# EAGLE design OpenPilot-v1 (EAGLE 5.06)

## Sheet 1 of 2
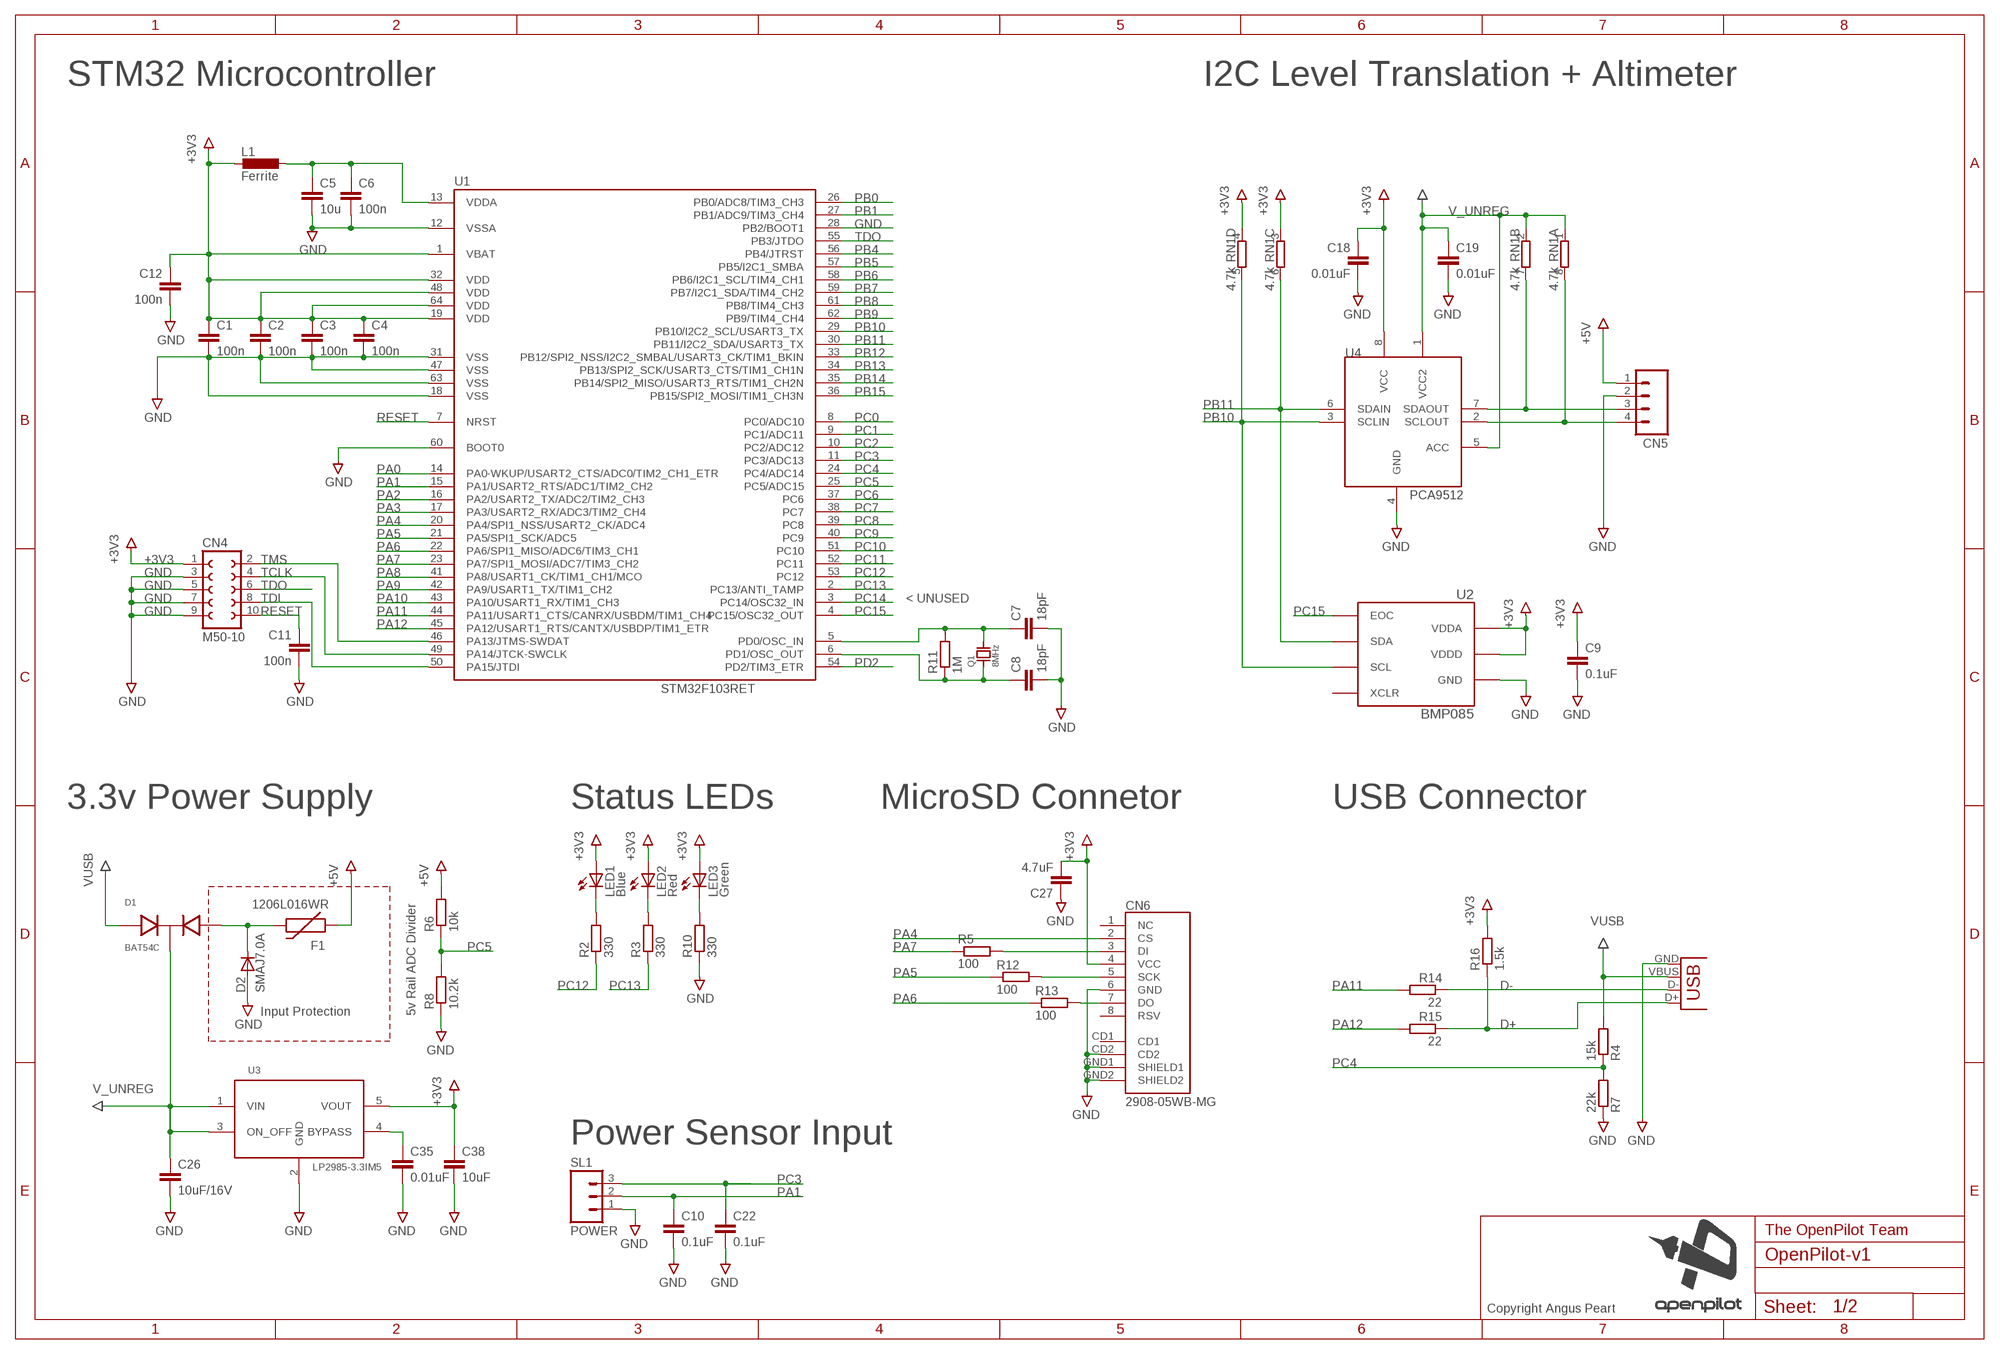
[diagram p0: schematic, sheet 1]

### Parts
C1  100n  C-EUC0603  [C0603]
C2  100n  C-EUC0603  [C0603]
C3  100n  C-EUC0603  [C0603]
C4  100n  C-EUC0603  [C0603]
C5  10u  C-EUC0805  [C0805]
C6  100n  C-EUC0603  [C0603]
C7  18pF  C-EUC0603  [C0603]
C8  18pF  C-EUC0603  [C0603]
C9  0.1uF  CAPACITOR0603  [0603]
C10  0.1uF  C-EUC0603  [C0603]
C11  100n  C-EUC0603  [C0603]
C12  100n  C-EUC0603  [C0603]
C18  0.01uF  C-EUC0603  [C0603]
C19  0.01uF  C-EUC0603  [C0603]
C22  0.1uF  C-EUC0603  [C0603]
C26  10uF/16V  C-EUC0805  [C0805]
C27  4.7uF  C-EUC0805  [C0805]
C35  0.01uF  C-EUC0603  [C0603]
C38  10uF  C-EUC0805  [C0805]
CN4  M50-10  [M50-10]
CN5  M04PTH  [1X04]
CN6  2908-05WB-MG  USD-SOCKETNEW  [MICRO-SD-SOCKET-PP]
D1  BAT54C  [SOT23]
D2  SMAJ7.0A  DIODESMA  [SMA-DIODE]
F1  1206L016WR  PTCSMD  [PTC-1206]
L1  Ferrite  L-EUL2012C  [L2012C]
LED1  Blue  LEDCHIPLED_0603  [CHIPLED_0603]
LED2  Red  LEDCHIPLED_0603  [CHIPLED_0603]
LED3  Green  LEDCHIPLED_0603  [CHIPLED_0603]
Q1  8MHz  CRYSTAL5X3  [CRYSTAL-5X3]
R2  330  R-EU_R0603  [R0603]
R3  330  R-EU_R0603  [R0603]
R4  15k  R-EU_R0603  [R0603]
R5  100  R-EU_R0603  [R0603]
R6  10k  R-EU_R0603  [R0603]
R7  22k  R-EU_R0603  [R0603]
R8  10.2k  R-EU_R0603  [R0603]
R10  330  R-EU_R0603  [R0603]
R11  1M  R-EU_R0603  [R0603]
R12  100  R-EU_R0603  [R0603]
R13  100  R-EU_R0603  [R0603]
R14  22  R-EU_R0603  [R0603]
R15  22  R-EU_R0603  [R0603]
R16  1.5k  R-EU_R0603  [R0603]
RN1  4.7k  4R-N0603-ARC  [0603-ARC]
SL1  POWER  M03PTH  [1X03]
U1  STM32F103RET  [LQFP-64]
U2  BMP085  [BMP085]
U3  LP2985-3.3IM5  [SOT23-5]
U4  PCA9512  [TSSOP8]
X1  USBSMD  [USB-MINIB]

### Nets
5V_SCL: CN5.4 RN1.8 U4.2(SCLOUT)
5V_SDA: CN5.3 RN1.7 U4.7(SDAOUT)
+3V3: C1.1 C2.1 C3.1 C4.1 C9.1 C12.1 C18.1 C27.2 C38.1 CN4.1 CN6.4(VCC) L1.2 LED1.A LED2.A LED3.A R16.2 RN1.3 RN1.4 U1.1(VBAT) U1.19(VDD) U1.32(VDD) U1.48(VDD) U1.64(VDD) U2.3(VDDA) U2.4(VDDD) U3.5(VOUT) U4.8(VCC)
+5V: CN5.1 F1.1 R6.2 ; also sheet 2
+5V-PRO: D1.2 D2.C F1.2
D+: R15.1 R16.1 X1.D+
D-: R14.1 X1.D-
GND: C1.2 C2.2 C3.2 C4.2 C5.2 C6.2 C7.2 C8.2 C9.2 C10.2 C11.2 C12.2 C18.2 C19.2 C22.2 C26.2 C27.1 C35.2 C38.2 CN4.3 CN4.5 CN4.7 CN4.9 CN5.2 CN6.6(GND) CN6.CD2 CN6.GND1(SHIELD1) CN6.GND2(SHIELD2) D2.A R7.1 R8.1 R10.1 SL1.1 U1.12(VSSA) U1.18(VSS) U1.28(PB2/BOOT1) U1.31(VSS) U1.47(VSS) U1.60(BOOT0) U1.63(VSS) U2.1(GND) U3.2(GND) U4.4(GND) X1.GND ; also sheet 2
N$2: LED1.C R2.2
N$4: LED2.C R3.2
N$11: LED3.C R10.2
N$12: C7.1 Q1.3 R11.2 U1.5(PD0/OSC_IN)
N$13: C5.1 C6.1 L1.1 U1.13(VDDA)
N$14: C8.1 Q1.1 R11.1 U1.6(PD1/OSC_OUT)
N$16: CN6.3(DI) R5.2
N$18: CN6.5(SCK) R12.2
N$19: CN6.7(DO) R13.2
N$38: C35.1 U3.4(BYPASS)
PA0: U1.14(PA0-WKUP/USART2_CTS/ADC0/TIM2_CH1_ETR) ; also sheet 2
PA1: C10.1 SL1.2 U1.15(PA1/USART2_RTS/ADC1/TIM2_CH2)
PA2: U1.16(PA2/USART2_TX/ADC2/TIM2_CH3) ; also sheet 2
PA3: U1.17(PA3/USART2_RX/ADC3/TIM2_CH4) ; also sheet 2
PA4: CN6.2(CS) U1.20(PA4/SPI1_NSS/USART2_CK/ADC4)
PA5: R12.1 U1.21(PA5/SPI1_SCK/ADC5)
PA6: R13.1 U1.22(PA6/SPI1_MISO/ADC6/TIM3_CH1)
PA7: R5.1 U1.23(PA7/SPI1_MOSI/ADC7/TIM3_CH2)
PA8: U1.41(PA8/USART1_CK/TIM1_CH1/MCO) ; also sheet 2
PA9: U1.42(PA9/USART1_TX/TIM1_CH2) ; also sheet 2
PA10: U1.43(PA10/USART1_RX/TIM1_CH3) ; also sheet 2
PA11: R14.2 U1.44(PA11/USART1_CTS/CANRX/USBDM/TIM1_CH4)
PA12: R15.2 U1.45(PA12/USART1_RTS/CANTX/USBDP/TIM1_ETR)
PB0: U1.26(PB0/ADC8/TIM3_CH3) ; also sheet 2
PB1: U1.27(PB1/ADC9/TIM3_CH4) ; also sheet 2
PB4: U1.56(PB4/JTRST) ; also sheet 2
PB5: U1.57(PB5/I2C1_SMBA) ; also sheet 2
PB6: U1.58(PB6/I2C1_SCL/TIM4_CH1) ; also sheet 2
PB7: U1.59(PB7/I2C1_SDA/TIM4_CH2) ; also sheet 2
PB8: U1.61(PB8/TIM4_CH3) ; also sheet 2
PB9: U1.62(PB9/TIM4_CH4) ; also sheet 2
PB10: RN1.5 U1.29(PB10/I2C2_SCL/USART3_TX) U2.6(SCL) U4.3(SCLIN)
PB11: RN1.6 U1.30(PB11/I2C2_SDA/USART3_TX) U2.7(SDA) U4.6(SDAIN)
PB12: U1.33(PB12/SPI2_NSS/I2C2_SMBAL/USART3_CK/TIM1_BKIN) ; also sheet 2
PB13: U1.34(PB13/SPI2_SCK/USART3_CTS/TIM1_CH1N) ; also sheet 2
PB14: U1.35(PB14/SPI2_MISO/USART3_RTS/TIM1_CH2N) ; also sheet 2
PB15: U1.36(PB15/SPI2_MOSI/TIM1_CH3N) ; also sheet 2
PC0: U1.8(PC0/ADC10) ; also sheet 2
PC1: U1.9(PC1/ADC11) ; also sheet 2
PC2: U1.10(PC2/ADC12) ; also sheet 2
PC3: C22.1 SL1.3 U1.11(PC3/ADC13)
PC4: R4.1 R7.2 U1.24(PC4/ADC14)
PC5: R6.1 R8.2 U1.25(PC5/ADC15)
PC6: U1.37(PC6) ; also sheet 2
PC7: U1.38(PC7) ; also sheet 2
PC8: U1.39(PC8) ; also sheet 2
PC9: U1.40(PC9) ; also sheet 2
PC10: U1.51(PC10) ; also sheet 2
PC11: U1.52(PC11) ; also sheet 2
PC12: R2.1 U1.53(PC12)
PC13: R3.1 U1.2(PC13/ANTI_TAMP)
PC14: U1.3(PC14/OSC32_IN)
PC15: U1.4(PC15/OSC32_OUT) U2.2(EOC)
PD2: U1.54(PD2/TIM3_ETR) ; also sheet 2
RESET: C11.1 CN4.10 U1.7(NRST)
TCLK: CN4.4 U1.49(PA14/JTCK-SWCLK)
TDI: CN4.8 U1.50(PA15/JTDI)
TDO: CN4.6 U1.55(PB3/JTDO)
TMS: CN4.2 U1.46(PA13/JTMS-SWDAT)
V_UNREG: C19.1 C26.1 D1.3 RN1.1 RN1.2 U3.1(VIN) U3.3(ON_OFF) U4.1(VCC2) U4.5(ACC)
VUSB: D1.1 R4.2 X1.VBUS
Unconnected: CN6.1(NC) CN6.8(RSV) CN6.CD1 U2.8(XCLR)

### Notes on the sheet
- STM32 Microcontroller | I2C Level Translation + Altimeter
- < UNUSED
- 3.3v Power Supply | Status LEDs | MicroSD Connetor | USB Connector
- Input Protection | 5v Rail ADC Divider
- Power Sensor Input
- The OpenPilot Team
- Copyright Angus Peart

## Sheet 2 of 2
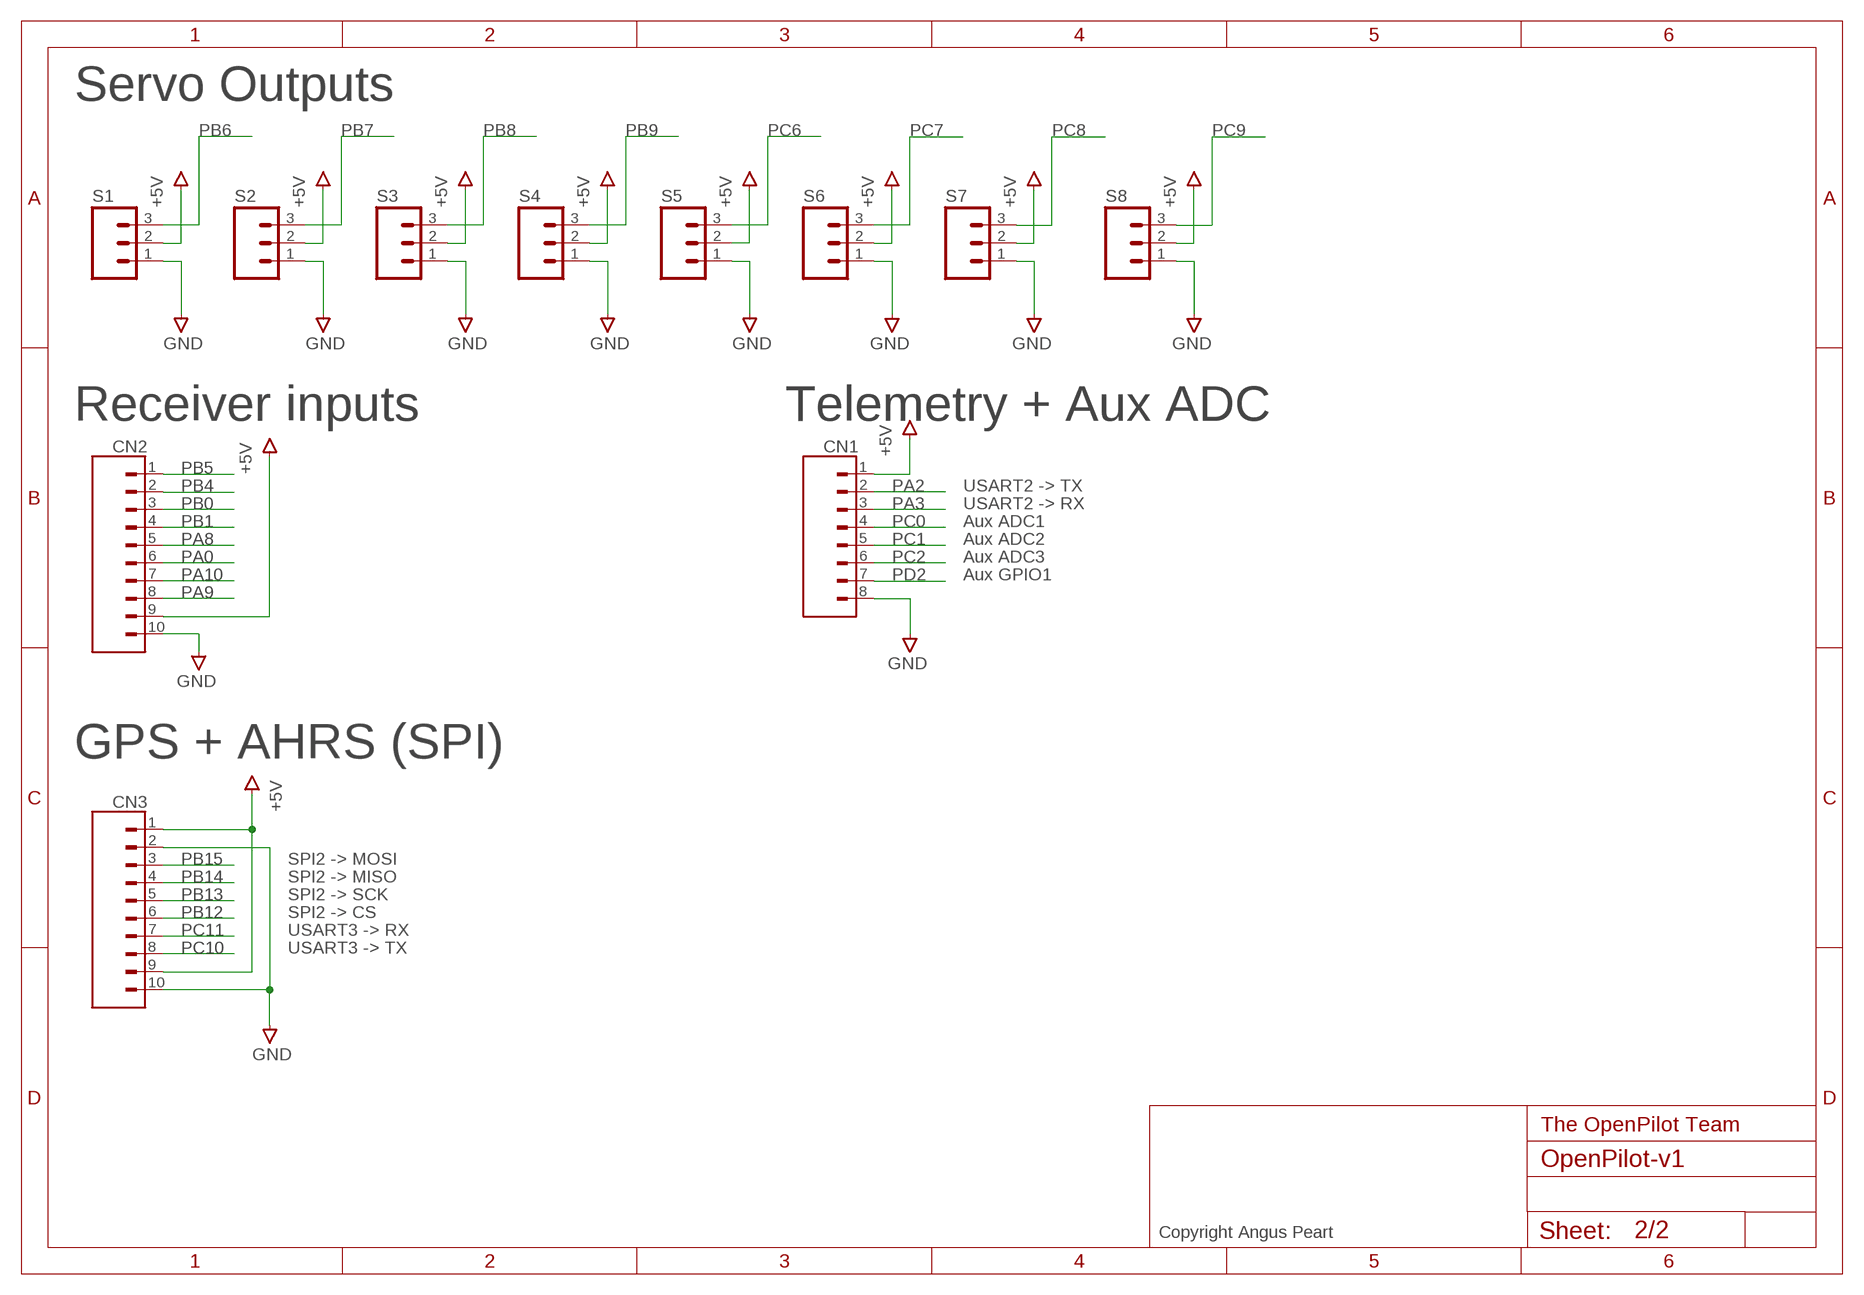
[diagram p1: schematic, sheet 2]

### Parts
CN1  BM08B-SRSS-TB  [BM08B-SRSS-TB]
CN2  BM10B-SRSS-TB  [BM10B-SRSS-TB]
CN3  BM10B-SRSS-TB  [BM10B-SRSS-TB]
S1  M03PTH  [1X03]
S2  M03PTH  [1X03]
S3  M03PTH  [1X03]
S4  M03PTH  [1X03]
S5  M03PTH  [1X03]
S6  M03PTH  [1X03]
S7  M03PTH  [1X03]
S8  M03PTH  [1X03]

### Nets
+5V: CN1.1 CN2.9 CN3.1 CN3.9 S1.2 S2.2 S3.2 S4.2 S5.2 S6.2 S7.2 S8.2 ; also sheet 1
GND: CN1.8 CN2.10 CN3.2 CN3.10 S1.1 S2.1 S3.1 S4.1 S5.1 S6.1 S7.1 S8.1 ; also sheet 1
PA0: CN2.6 ; also sheet 1
PA2: CN1.2 ; also sheet 1
PA3: CN1.3 ; also sheet 1
PA8: CN2.5 ; also sheet 1
PA9: CN2.8 ; also sheet 1
PA10: CN2.7 ; also sheet 1
PB0: CN2.3 ; also sheet 1
PB1: CN2.4 ; also sheet 1
PB4: CN2.2 ; also sheet 1
PB5: CN2.1 ; also sheet 1
PB6: S1.3 ; also sheet 1
PB7: S2.3 ; also sheet 1
PB8: S3.3 ; also sheet 1
PB9: S4.3 ; also sheet 1
PB12: CN3.6 ; also sheet 1
PB13: CN3.5 ; also sheet 1
PB14: CN3.4 ; also sheet 1
PB15: CN3.3 ; also sheet 1
PC0: CN1.4 ; also sheet 1
PC1: CN1.5 ; also sheet 1
PC2: CN1.6 ; also sheet 1
PC6: S5.3 ; also sheet 1
PC7: S6.3 ; also sheet 1
PC8: S7.3 ; also sheet 1
PC9: S8.3 ; also sheet 1
PC10: CN3.8 ; also sheet 1
PC11: CN3.7 ; also sheet 1
PD2: CN1.7 ; also sheet 1

### Notes on the sheet
- Servo Outputs
- Receiver inputs | Telemetry + Aux ADC
- USART2 -> TX
- USART2 -> RX
- Aux ADC1
- Aux ADC2
- Aux ADC3
- Aux GPIO1
- GPS + AHRS (SPI)
- SPI2 -> MOSI
- SPI2 -> MISO
- SPI2 -> SCK
- SPI2 -> CS
- USART3 -> RX
- USART3 -> TX
- The OpenPilot Team
- Copyright Angus Peart

## Library data of the parts
C1-C8 C10-C12 C18 C19 C22 C26 C27 C35 C38 = rcl:C-EU: CAPACITOR, European symbol
C9 = GUS Eng:CAPACITOR: Capacitor Standard SMD ceramic capacitors.
CN1 = zik:BM08B-SRSS-TB: JST SR connector - 8 pins, SMT
CN2 CN3 = zik:BM10B-SRSS-TB: JST SR connector -10 pins, SMT
CN4 = zik:M50-10: Harwin M50 1.27mm spaced 10 pin 2 row header
CN5 = sparkfun:M04: Header 4 Standard 4-pin 0.1" header. Use with straight break away headers (SKU : PRT-00116), right angle break away headers (PRT-00553), swiss pins (PRT-00743), machine pins (PRT-00117), and female headers (PRT-00115). Molex polarized connector foot print use with SKU : PRT-08231 with associated crimp pins and housings.
CN6 = sparkfun:USD-SOCKET: microSD Socket Push-push type uSD socket. Schematic element and footprint production proven. Spark Fun Electronics SKU : PRT-00127. tDoc lines correctly indicate media card edge positions when inserting (unlocked, locked, depressed).
D1 = zik:BAT54C: Dual schottky diode
D2 = sparkfun:DIODE: Diode These are standard reverse protection diodes and small signal diodes. SMA package can handle up to about 1A. SOD-323 can handle about 200mA. What the SOD-323 package when ordering, there are some mfgs out there that are 5-pin packages.
F1 = sparkfun:PTC: Resettable Fuse PTC Resettable Fuse. Spark Fun Electronics SKU : COM-08357
L1 = rcl:L-EU: INDUCTOR, European symbol
LED1-LED3 = led:LED: LED OSRAM: - CHIPLED LG R971, LG N971, LY N971, LG Q971, LY Q971, LO R971, LY R971 LH N974, LH R974 LS Q976, LO Q976, LY Q976 LO Q996 - Hyper CHIPLED LW Q18S LB Q993, LB Q99A, LB R99A - SideLED LS A670, LO A670, LY A670, LG A670, LP A670 LB A673, LV A673, LT A673, LW A673 LH A674 LY A675 LS A676, LA A676, LO A676, LY A676, LW A676 LS A679, LY A679, LG A679 - Hyper Micro SIDELED® LS Y876, LA Y876, LO Y876, LY Y876 LT Y87S - SmartLED LW L88C, LW L88S LB L89C, LB L89S, LG L890 LS L89K, LO L89K, LY L89K LS L896, LA L896, LO L896, LY L896 - TOPLED LS T670, LO T670, LY T670, LG T670, LP T670 LSG T670, LSP T670, LSY T670, LOP T670, LYG T670 LG T671, LOG T671, LSG T671 LB T673, LV T673, LT T673, LW T673 LH T674 LS T676, LA T676, LO T676, LY T676, LB T676, LH T676, LSB T676, LW T676 LB T67C, LV T67C, LT T67C, LS T67K, LO T67K, LY T67K, LW E67C LS E67B, LA E67B, LO E67B, LY E67B, LB E67C, LV E67C, LT E67C LW T67C LS T679, LY T679, LG T679 LS T770, LO T770, LY T770, LG T770, LP T770 LB T773, LV T773, LT T773, LW T773 LH T774 LS E675, LA E675, LY E675, LS T675 LS T776, LA T776, LO T776, LY T776, LB T776 LHGB T686 LT T68C, LB T68C - Hyper Mini TOPLED® LB M676 - Mini TOPLED Santana® LG M470 LS M47K, LO M47K, LY M47K Source: http://www.osram.convergy.de LUXEON: - LUMILED® LXK2-PW12-R00, LXK2-PW12-S00, LXK2-PW14-U00, LXK2-PW14-V00 LXK2-PM12-R00, LXK2-PM12-S00, LXK2-PM14-U00 LXK2-PE12-Q00, LXK2-PE12-R00, LXK2-PE12-S00, LXK2-PE14-T00, LXK2-PE14-U00 LXK2-PB12-K00, LXK2-PB12-L00, LXK2-PB12-M00, LXK2-PB14-N00, LXK2-PB14-P00, LXK2-PB14-Q00 LXK2-PR12-L00, LXK2-PR12-M00, LXK2-PR14-Q00, LXK2-PR14-R00 LXK2-PD12-Q00, LXK2-PD12-R00, LXK2-PD12-S00 LXK2-PH12-R00, LXK2-PH12-S00 LXK2-PL12-P00, LXK2-PL12-Q00, LXK2-PL12-R00 Source: www.luxeon.com KINGBRIGHT: KA-3528ASYC Source: www.kingbright.com
Q1 = GUS Eng:CRYSTAL: Crystals 5x3 Package: Digikey part: CTX639CT-ND (12MHz 13pF)
R2-R8 R10-R16 = rcl:R-EU_: RESISTOR, European symbol
RN1 = resistor-dil:4R-N: Array Chip Resistor Source: RS Component / Phycomp
S1-S8 SL1 = sparkfun:M03: Header 3 Standard 3-pin 0.1" header. Use with straight break away headers (SKU : PRT-00116), right angle break away headers (PRT-00553), swiss pins (PRT-00743), machine pins (PRT-00117), and female headers (PRT-00115). Molex polarized connector foot print use with SKU : PRT-08232 with associated crimp pins and housings.
U1 = zik:STM32F103*: Cortex M3 ARM-based 32-bit MCU with 64KB to 512KB Flash, 20KB to 64KB RAM, USB, CAN, 11 timers, 3 ADCs, 13 communication interfaces
U2 = GUS Eng:BMP085: BMP085 Digital Pressure Sensor Digikey #: 828-1005-1-ND
U3 = zik:LP2985-*: National Semiconductor LP2985 LDO regulator
U4 = zik:PCA9512: Phillips PCA9512 I2C level translator
X1 = sparkfun:USB: USB Connectors USB-B-PTH is fully proven SKU : PRT-00139 USB-miniB is fully proven SKU : PRT-00587 USB-A-PCB is untested. USB-A-H is throughly reviewed, but untested. Spark Fun Electronics SKU : PRT-00437 USB-B-SMT is throughly reviewed, but untested. Needs silkscreen touching up. USB-A-S has not been used/tested USB-MB-H has not been used/tested

## Board
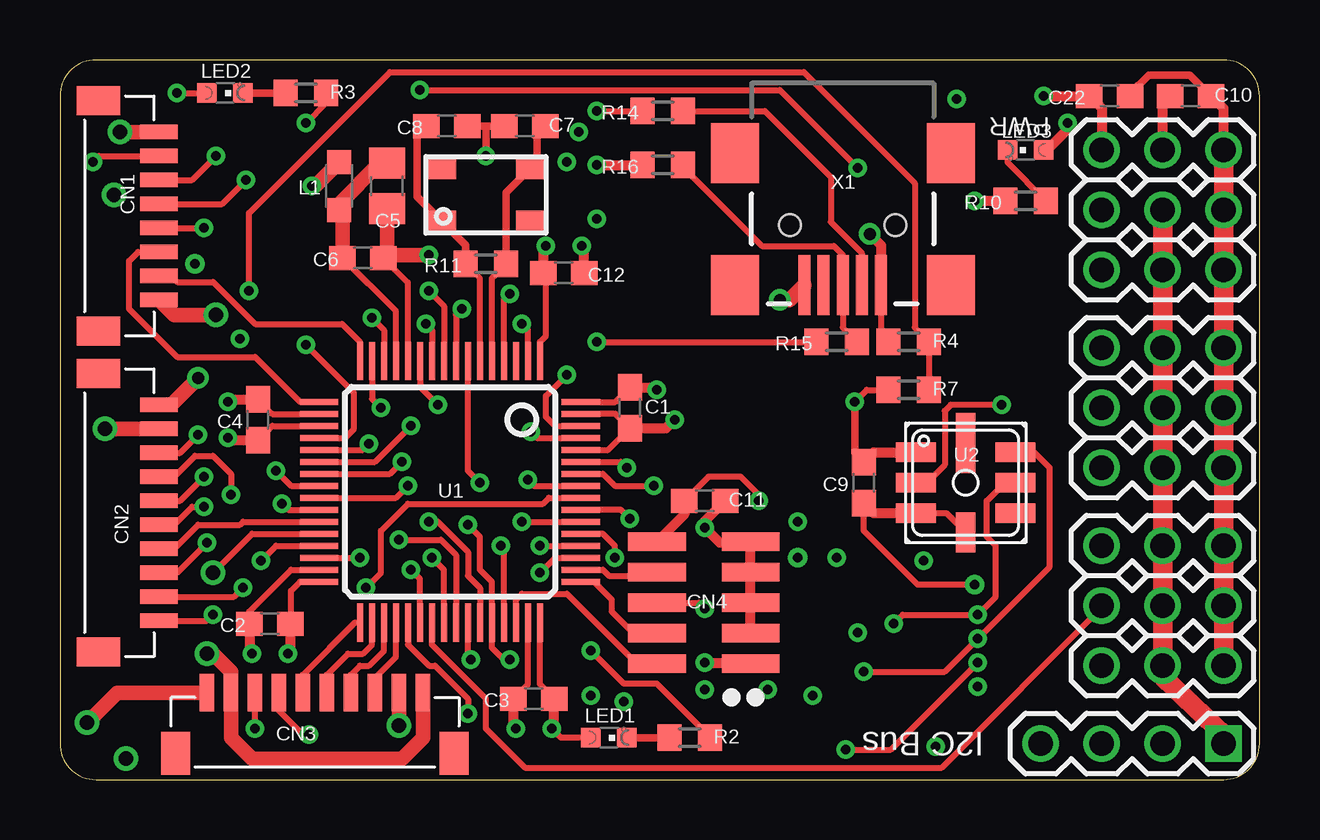
[diagram p2: board, top side]
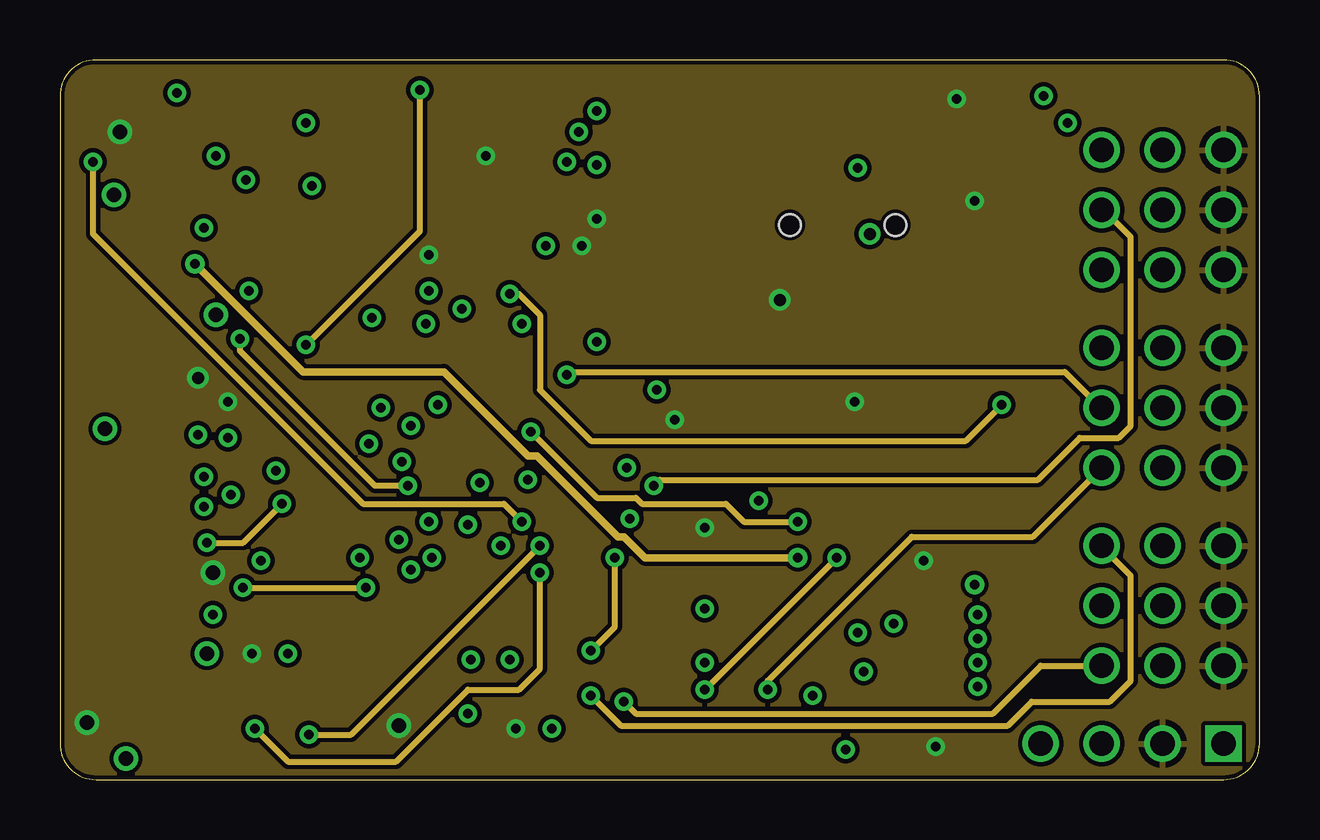
[diagram p3: board, inner layer Route2]
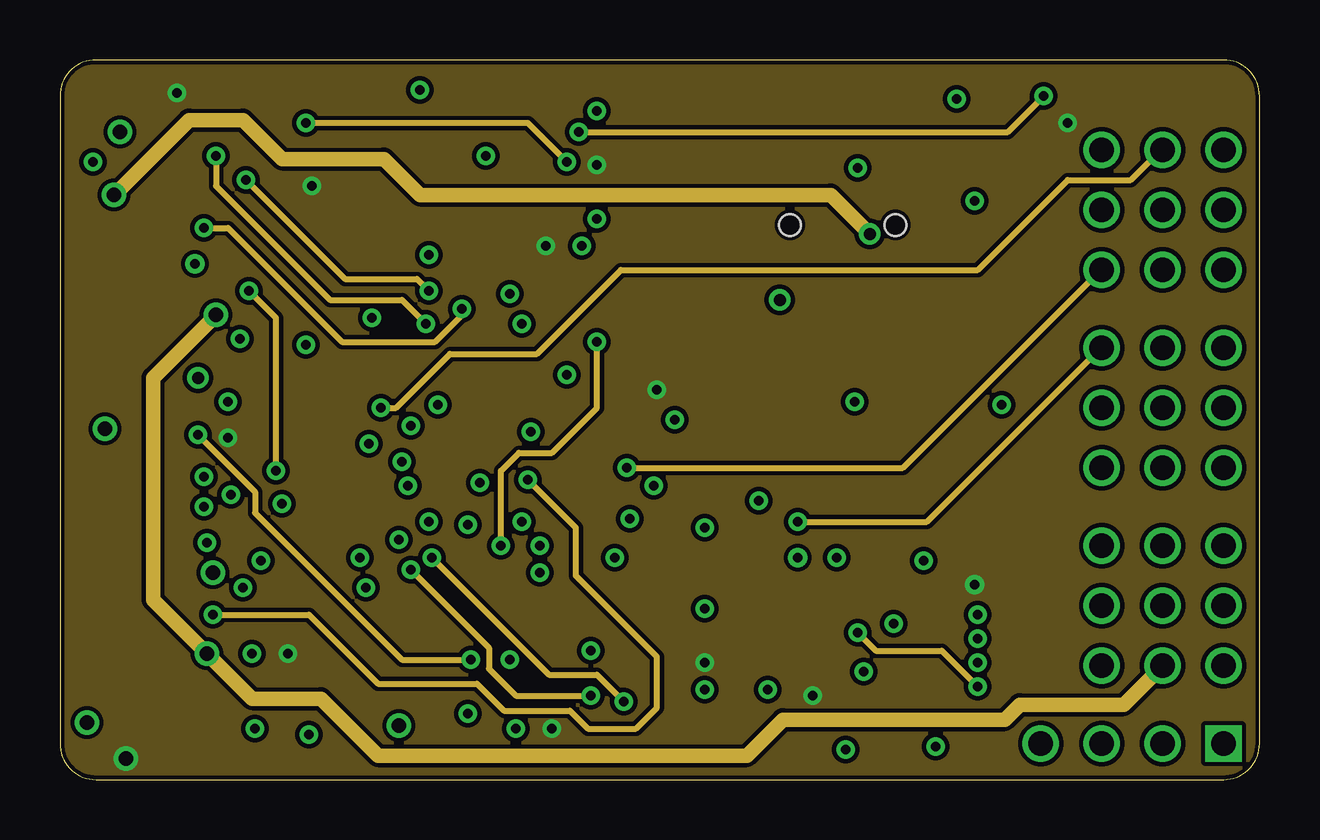
[diagram p4: board, inner layer Route15]
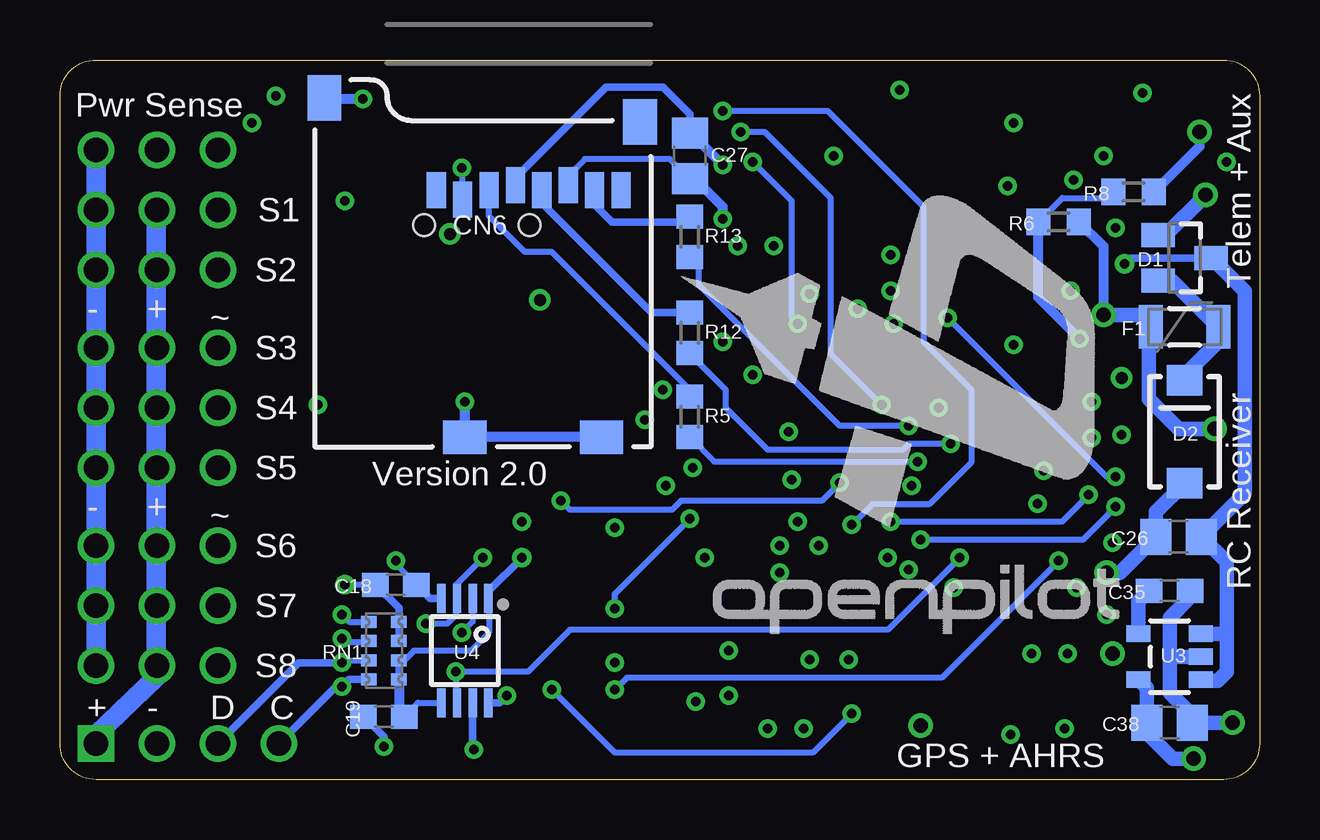
[diagram p5: board, bottom side, seen from below]

Size 50 x 30 mm. Coordinates in mm from the lower left corner, seen from the top.
Outline: 48.5,0 arc90 50,1.5 50,28.5 arc90 48.5,30 1.5,30 arc90 0,28.5 0,1.5 arc90 1.5,0 48.5,0
Copper layers (1*2+15*16): Top 0.0356mm / dielectric 1.5011mm / Route2 0.0356mm / dielectric 0.1499mm / Route15 0.0356mm / dielectric 0.2007mm / Bottom 0.0356mm
Design rules "7mils GUS Engineering (4 Layer) *": minimum track width 7mil, minimum drill 15mil, track to track 7mil, track to pad 7mil, pad to pad 7mil, via to via 7mil, smd to smd 0mil, copper to edge 7mil, drill to drill 7mil, minimum pad ring 10mil, minimum via ring 8mil, stop-mask expansion 4mil, vias tented up to drill 25mil, thermal gap 10mil

### Footprints (pad centres in the part's own frame; a part is rotated, then mirrored left to right if it is on the bottom)
C0603 = smd 1.1 x 1: 1 -0.85,0; 2 0.85,0
C0805 = smd 1.3 x 1.5: 1 -0.95,0; 2 0.95,0
0603 = smd 1.1 x 1: 1 -0.85,0; 2 0.85,0
BM08B-SRSS-TB = smd 0.6 x 1.55: 1 7,0; 2 6,0; 3 5,0; 4 4,0; 5 3,0; 6 2,0; 7 1,0; 8 0,0 | smd 1.2 x 1.8: NC@1 -1.3,-2.525; NC@2 8.3,-2.525
BM10B-SRSS-TB = smd 0.6 x 1.55: 1 9,0; 2 8,0; 3 7,0; 4 6,0; 5 5,0; 6 4,0; 7 3,0; 8 2,0; 9 1,0; 10 0,0 | smd 1.2 x 1.8: NC@1 -1.3,-2.525; NC@2 10.3,-2.525
M50-10 = smd 0.76 x 2.4: 1 -2.54,-1.95; 2 -2.54,1.95; 3 -1.27,-1.95; 4 -1.27,1.95; 5 0,-1.95; 6 0,1.95; 7 1.27,-1.95; 8 1.27,1.95; 9 2.54,-1.95; 10 2.54,1.95
1X04 = drill 1.016 square: 1 0,0 | drill 1.016 round: 2 2.54,0; 3 5.08,0; 4 7.62,0
MICRO-SD-SOCKET-PP = smd 0.8 x 1.5: 1 -8.94,10.7; 2 -7.84,10.3; 3 -6.74,10.7; 4 -5.64,10.9; 5 -4.54,10.7; 6 -3.44,10.9; 7 -2.34,10.7; 8 -1.24,10.7 | smd 1.4 x 1.9: CD1 -0.45,13.55; GND1 -13.6,14.55 | smd 1.8 x 1.4: CD2 -2.05,0.4; GND2 -7.75,0.4
SOT23 = smd 1 x 1.4: 1 -0.95,-1.1; 2 0.95,-1.1; 3 0,1.1
SMA-DIODE = smd 1.27 x 1.47: A -2.15,0; C 2.15,0
PTC-1206 = smd 1 x 1.8: 1 -1.4,0; 2 1.4,0
L2012C = smd 1 x 1: 1 -1,0; 2 1,0
CHIPLED_0603 = smd 0.8 x 0.8: A 0,-0.75; C 0,0.75
CRYSTAL-5X3 = smd 1.2 x 0.9: 1 1.85,1.1; 2 -1.85,1.1; 3 -1.85,-1.1; 4 1.85,-1.1
R0603 = smd 1 x 1.1: 1 -0.85,0; 2 0.85,0
0603-ARC = smd 0.5 x 0.65: 1 -1.2,-0.625; 2 -0.4,-0.625; 3 0.4,-0.625; 4 1.2,-0.625; 5 1.2,0.625; 6 0.4,0.625; 7 -0.4,0.625; 8 -1.2,0.625
1X03 = drill 1.016 round: 1 0,0; 2 2.54,0; 3 5.08,0
LQFP-64 = smd 0.25 x 1.6: 1 -3.75,-5.45; 2 -3.25,-5.45; 3 -2.75,-5.45; 4 -2.25,-5.45; 5 -1.75,-5.45; 6 -1.25,-5.45; 7 -0.75,-5.45; 8 -0.25,-5.45; 9 0.25,-5.45; 10 0.75,-5.45; 11 1.25,-5.45; 12 1.75,-5.45; 13 2.25,-5.45; 14 2.75,-5.45; 15 3.25,-5.45; 16 3.75,-5.45; 33 3.75,5.45; 34 3.25,5.45; 35 2.75,5.45; 36 2.25,5.45; 37 1.75,5.45; 38 1.25,5.45; 39 0.75,5.45; 40 0.25,5.45; 41 -0.25,5.45; 42 -0.75,5.45; 43 -1.25,5.45; 44 -1.75,5.45; 45 -2.25,5.45; 46 -2.75,5.45; 47 -3.25,5.45; 48 -3.75,5.45 | smd 1.6 x 0.25: 17 5.45,-3.75; 18 5.45,-3.25; 19 5.45,-2.75; 20 5.45,-2.25; 21 5.45,-1.75; 22 5.45,-1.25; 23 5.45,-0.75; 24 5.45,-0.25; 25 5.45,0.25; 26 5.45,0.75; 27 5.45,1.25; 28 5.45,1.75; 29 5.45,2.25; 30 5.45,2.75; 31 5.45,3.25; 32 5.45,3.75; 49 -5.45,3.75; 50 -5.45,3.25; 51 -5.45,2.75; 52 -5.45,2.25; 53 -5.45,1.75; 54 -5.45,1.25; 55 -5.45,0.75; 56 -5.45,0.25; 57 -5.45,-0.25; 58 -5.45,-0.75; 59 -5.45,-1.25; 60 -5.45,-1.75; 61 -5.45,-2.25; 62 -5.45,-2.75; 63 -5.45,-3.25; 64 -5.45,-3.75
BMP085 = smd 1.67 x 0.8: 1 -2.08,1.27; 2 -2.08,0; 3 -2.08,-1.27; 5 2.08,-1.27; 6 2.08,0; 7 2.08,1.27 | smd 0.8 x 1.67: 4 0,-2.08 | smd 0.8 x 2.5: 8 0,1.66
SOT23-5 = smd 0.69 x 0.99: 1 -0.95,-1.3; 2 0,-1.3; 3 0.95,-1.3; 4 0.95,1.3; 5 -0.95,1.3
TSSOP8 = smd 0.35 x 1.2: 1 -0.975,-2.175; 2 -0.325,-2.175; 3 0.325,-2.175; 4 0.975,-2.175; 5 0.975,2.175; 6 0.325,2.175; 7 -0.325,2.175; 8 -0.975,2.175
USB-MINIB = smd 2.5 x 0.5: D+ 2.5,0; D- 2.5,0.8; GND 2.5,-1.6; ID 2.5,-0.8; VBUS 2.5,1.6 | smd 2.5 x 2: GND@1 -3,-4.5; GND@2 -3,4.5; GND@3 2.5,4.5; GND@4 2.5,-4.5 | hole 0.9: 0,2.2; 0,-2.2

### Placement (x,y rotation side)
C1  23.75,15.5 270 top
C2  8.75,6.5 180 top
C3  19.75,3.38 180 top
C4  8.25,15 90 top
C5  13.62,24.75 270 top
C6  12.62,21.75 0 top
C7  19.38,27.25 180 top
C8  16.12,27.25 0 top
C9  33.5,12.38 90 top
C10  47.12,28.5 0 top
C11  26.88,11.62 0 top
C12  21,21.12 0 top
C18  36,8.12 0 bottom
C19  36.5,2.62 180 bottom
C22  43.75,28.5 0 top
C26  3.38,10.12 180 bottom
C27  23.75,26 90 bottom
C35  3.75,7.88 0 bottom
C38  3.75,2.38 0 bottom
CN1  4.12,27 270 top
CN2  4.12,15.62 270 top
CN3  6.12,3.62 0 top
CN4  26.84,7.38 90 top
CN5  48.5,1.5 180 top
CN6  25.38,13.88 0 bottom
D1  3.12,21.75 270 bottom
D2  3.12,14.5 90 bottom
F1  3.12,18.88 0 bottom
L1  11.62,24.75 90 top
LED1  22.88,1.75 270 top
LED2  6.88,28.62 270 top
LED3  40.25,26.25 90 top
Q1  17.75,24.38 180 top
R2  26.25,1.75 180 top
R3  10.25,28.62 180 top
R4  35.38,18.25 180 top
R5  23.75,15.12 90 bottom
R6  8.38,23.25 0 bottom
R7  35.38,16.25 0 top
R8  5.25,24.5 180 bottom
R10  40.25,24.12 0 top
R11  17.75,21.5 0 top
R12  23.75,18.62 90 bottom
R13  23.75,22.62 90 bottom
R14  25.12,27.88 180 top
R15  32.38,18.25 180 top
R16  25.12,25.62 180 top
RN1  36.5,5.38 90 bottom
S1  48.5,23.75 180 top
S2  48.5,21.25 180 top
S3  48.5,18 180 top
S4  48.5,15.5 180 top
S5  48.5,13 180 top
S6  48.5,9.75 180 top
S7  48.5,7.25 180 top
S8  48.5,4.75 180 top
SL1  48.5,26.25 180 top
U1  16.25,12 180 top
U2  37.75,12.38 0 top
U3  3.75,5.12 90 bottom
U4  33.12,5.38 180 bottom
U$2  LOGO_BRD_MAIN_BOT  [LOGO-MAIN-BOT]  23.12,5.75 0 bottom
X1  32.62,23.12 270 top

### Tracks (layer width: path | path; a pad name or v marks a point on that pad's centre or on a via)
5V_SCL  (via drill 0.38)
  Route15 0.254: v33.25,6.12 34,5.38 36.75,5.38 v38.25,3.88
  Bottom 0.254: U4.2 32.8,6.58 v33.25,6.12
  Bottom 0.305: RN1.8 37.95,4.17 v38.25,3.88 38.51,3.88 CN5.4
5V_SDA  (via drill 0.38)
  Top 0.254: v38.25,4.88 34.62,1.25 v32.75,1.25
  Bottom 0.254: RN1.7 38.15,4.97 v38.25,4.88
  Bottom 0.305: v32.75,1.25 32.8,1.3 U4.7 | v38.25,4.88 40.05,4.88 CN5.3
+3V3  (via drill 0.38, 0.4, 0.6)
  Top 0.254: U1.1 20,18.25 20.25,18.5 20.25,20.75 20,21 20,20.98 C12.1 | U1.64 23.15,15.75 C1.1 | U1.48 20,3.98 C3.1 | U1.19 8.85,14.75 C4.1 | 28.82,4.88 CN4.1 | U1.32 10,8.25 9.62,7.88 9.62,6.5 C2.1 | LED1.A 20.88,1.75 v20.5,2.12 | v4.88,28.62 LED2.A | v38.12,8.12 35.75,8.12 33.5,10.38 C9.1 | U2.4 36.94,11.11 U2.3
  Top 0.305: LED3.A 41.12,26.25
  Top 0.406: C12.1 20.15,22.15 v20.25,22.25 | C1.1 24.77,16.35 v24.88,16.25 | C3.1 20.6,2.23 v20.5,2.12 | C2.1 9.6,5.35 v9.5,5.25 | C4.1 7.1,14.15 v7,14.25 | v26.88,4.88 28.82,4.88 | C9.1 33.92,11.11 U2.3 | 41.12,26.25 42,27.12 v42,27.38 | v22.38,25.62 R16.2
  Top 0.61: L1.2 10.62,24.75 v10.5,24.75
  Bottom 0.254: C18.1 v38.12,8.12
  Bottom 0.305: C18.1 35.88,7.15 RN1.4 RN1.3 | v31.38,3.5 31.68,3.2 U4.8 | 31,24.76 31,25.12 27.25,28.88 24.88,28.88 23.75,27.75 C27.2
  Bottom 0.406: 31,24.76 CN6.4 | v22.38,25.62 23.7,26.95 C27.2
  Bottom 0.61: 5.17,4.17 U3.5 4.7,3.83 C38.1 4.7,1.95 3.62,0.88 v2.75,0.88
  pour Route15: 0,0 0,30 50,30 50,0
+5V  (via drill 0.6)
  Top 0.61: v1.88,14.62 CN2.9 | CN3.1 15.12,1.75 14.25,0.88 8,0.88 7.12,1.75 CN3.9 7.12,4.5 6.38,5.25 v6.12,5.25 | CN1.1 4.75,19.38 v6.5,19.38
  Top 0.813: S8.2 S7.2 S6.2 S5.2 S4.2 S3.2 S2.2 S1.2 | CN5.1 48.5,1.88 46,4.25 46,4.75
  Route15 0.61: S8.2 44.34,3.12 40,3.12 39.38,2.5 30.12,2.5 28.62,1 13.25,1 10.88,3.38 8,3.38 v6.12,5.25 3.88,7.5 3.88,16.75 v6.5,19.38
  Bottom 0.406: S1.2 45.96,23.14 | S2.2 45.96,20.27 | S3.2 45.96,17.39 | S4.2 45.96,14.89 | S5.2 45.96,12.02 | S6.2 45.96,9.14 | S7.2 45.96,6.64 | R6.2 6.5,22.23 v6.5,19.38
  Bottom 0.61: v6.5,19.38 5.03,19.38 F1.1 4.62,18.77 4.62,15.88 3.38,14.62 v1.88,14.62
  Bottom 0.813: 46,4.75 46,23.75 | S8.2 45.96,4.29 48.5,1.88 CN5.1
  Bottom 1.27: S8.2 46,4.75
+5V-PRO
  Bottom 0.61: D1.2 3.65,20.8 F1.2 1.75,18.85 1.75,18.25 3.12,16.88 D2.C
D+
  Top 0.254: R15.1 32.62,18.85 X1.D+ 32.62,21.88 32.25,22.25 29.25,22.25 26,25.5 26,25.6 R16.1
D-
  Top 0.254: X1.D- 33.42,21.95 32.12,23.25 32.12,25.12 29.38,27.88 R14.1
GND  (via drill 0.38, 0.5, 0.6)
  Top 0.254: C6.2 14.5,20.73 U1.12 | U1.63 23.15,15.25 C1.2 22.85,13.75 U1.60 | U1.47 19.5,3.98 C3.2 | U1.18 8.85,15.25 C4.2 | R7.1 33.62,16.25 v33.12,15.75 | U1.31 9.62,8.75 7.88,7 7.88,6.53 C2.2 | U1.28 8,10.25 v6.38,8.62
  Top 0.305: C8.2 17.75,27.25 | 17.75,27.25 C7.2 | 17.75,27.25 v17.75,26 | C9.2 33.12,13.6 v33.12,15.75 | C22.2 44.6,28.6 45.38,29.38 47.1,29.38 C10.2
  Top 0.406: C12.2 21.85,22.15 v21.75,22.25 | C1.2 25.27,14.65 v25.62,15 | C3.2 18.9,2.23 v19,2.12 | C2.2 7.9,5.35 v8,5.25 | C4.2 7.1,15.85 v7,15.75 | CN4.3 CN4.5 CN4.7 CN4.9 28.75,9.88 27.5,9.88 v26.88,10.5 26.88,10.78 C11.2 | U2.1 33.92,13.64 C9.2 | C22.2 44.62,28.5 | SL1.1 48.5,27.98 C10.2 | R10.1 v38.12,24.12
  Top 0.61: 13.62,21.9 C5.2 | C6.2 13.62,21.9 | 13.62,21.9 13.65,21.88 v15.38,21.88 | v30,20 30.4,20 X1.GND | CN2.10 4.62,15.62 v5.75,16.75 | CN3.10 2.38,3.62 v1.12,2.38 | v14.12,2.25 CN3.2 | v2.5,27 CN1.8
  Top 0.813: S8.1 SL1.1
  Bottom 0.254: CN6.6 28.82,25.18 28.12,25.88 24.57,25.88 C27.1 | v36,9.12 36,8.97 C18.2
  Bottom 0.305: C18.2 34.58,7.55 U4.4 | v36.5,1.38 36.5,1.77 C19.2
  Bottom 0.406: v37.38,28.38 38.92,28.38 CN6.GND1 | v33.12,15.75 CN6.GND2 CN6.CD2 | SL1.1 48.5,25.6 | S1.1 48.5,23.1 | S2.1 48.5,20.23 | S3.1 48.5,17.35 | 48.5,15 48.5,14.85 | S5.1 48.5,11.97 | S6.1 48.5,9.1 | S7.1 48.5,6.6 | R8.1 2.5,26.4 v2.5,27 | v22.38,23.38 22.38,23.88 23.55,25.05 C27.1
  Bottom 0.61: C35.2 2.9,7.6 3.75,6.75 3.75,5.12 | 3.75,5.12 U3.2 | C38.2 2.8,2.67 3.75,3.62 3.75,5.12 | v1.12,2.38 C38.2 | C38.2 2.88,2.38 | D2.A 4.33,11.15 C26.2 5.83,8.62 v6.38,8.62
  Bottom 0.813: S8.1 S7.1 S6.1 S5.1 48.5,15 S3.1 S2.1 S1.1 SL1.1
  pour Route2: 0,0 0,30 50,30 50,0
N$2
  Top 0.305: LED1.C R2.2
N$4
  Top 0.305: R3.2 LED2.C
N$11
  Top 0.254: LED3.C 39.5,25.73 R10.2
N$12
  Top 0.254: R11.2 18,20.9 U1.5 | Q1.3 19.6,25.57 19.88,25.85
  Top 0.305: Q1.3 18.6,24.48 R11.2 | 19.88,25.85 19.88,26.9 C7.1
N$13
  Top 0.254: C6.1 14,19.52 U1.13
  Top 0.61: C5.1 13.32,25.7 11.62,24 L1.1 11.78,23.6 C6.1
N$14
  Top 0.254: R11.1 17.5,20.9 U1.6
  Top 0.305: C8.1 14.88,26.85 14.88,24.3 Q1.1 16.9,22.27 R11.1
N$16
  Bottom 0.254: CN6.3 32.12,23.5 30.62,22 29.5,22 23.75,16.25 R5.2
  Bottom 0.406: CN6.3
N$18
  Bottom 0.305: R12.2 25.35,19.48 29.88,24 29.88,24.54
  Bottom 0.406: 29.88,24.54 CN6.5
N$19
  Bottom 0.305: R13.2 23.75,23.25 27,23.25 27.75,24 27.75,24.54
  Bottom 0.406: 27.75,24.54 CN6.7
N$38
  Bottom 0.61: U3.4 5.05,7.42 C35.1
PA0  (via drill 0.38)
  Top 0.254: v13,19.25 13.5,18.75 U1.14 | v6,12.62 5,11.62 CN2.6
  Bottom 0.254: v6,12.62 6.38,12.62 v13,19.25
PA1  (via drill 0.38)
  Top 0.254: U1.15 13,15.88 v13.38,15.5
  Top 0.406: SL1.2 45.96,28.18 C10.1
  Route15 0.254: v13.38,15.5 14,15.5 16.25,17.75 19.88,17.75 23.38,21.25 38.25,21.25 42,25 44.62,25 45.88,26.25 SL1.2
PA2
  Top 0.254: U1.16 12.5,18.25 11.75,19 8.12,19 6.38,20.75 4.88,20.75 4.62,21 CN1.2
PA3
  Top 0.254: U1.17 10,15.75 8.12,17.62 4.88,17.62 2.88,19.62 2.88,21.62 3.25,22 CN1.3
PA4  (via drill 0.38)
  Top 0.254: U1.20 11.88,14.25 12.25,14.62 12.25,16.12 v10.25,18.12 | v33.25,25.5 30,28.75 v15,28.75
  Route2 0.254: v10.25,18.12 15,22.88 v15,28.75
  Bottom 0.254: CN6.2 33.22,24.59 33.25,24.62 v33.25,25.5
PA5  (via drill 0.38)
  Top 0.254: U1.21 12.62,13.75 v12.88,14
  Bottom 0.254: R12.1 23.75,17.75 22.25,16.25 22.25,15.5 20.5,13.75 14.88,13.75 14.62,14 v12.88,14
PA6  (via drill 0.38)
  Top 0.254: v14.62,14.75 13.12,13.25 U1.22
  Bottom 0.254: R13.1 23.38,21.4 23.38,20.62 17.5,14.75 v14.62,14.75
PA7  (via drill 0.38)
  Top 0.254: v14.25,13.25 13.75,12.75 U1.23
  Bottom 0.254: R5.1 22.73,13.25 v14.25,13.25
PA8  (via drill 0.38)
  Top 0.254: v14.12,10 15.88,10 16.5,9.38 U1.41 | v6,11.38 5.5,11.38 4.75,10.62 CN2.5
  Bottom 0.254: v6,11.38 7.38,10 v14.12,10
PA9  (via drill 0.38)
  Top 0.254: v17.12,5 17,5.12 U1.42 | CN2.8 5,13.62 v5.75,14.38
  Route15 0.254: v5.75,14.38 8.12,12 8.12,11.12 14.25,5 v17.12,5
PA10  (via drill 0.38)
  Top 0.254: v7.12,11.88 7.12,12.75 6.38,13.5 5.62,13.5 4.75,12.62 CN2.7 | v15.38,10.75 15.75,10.75 17,9.5 17,8.5 17.5,8 U1.43
  Bottom 0.254: v7.12,11.88 8.25,10.75 v15.38,10.75
PA11  (via drill 0.38)
  Top 0.254: v18.75,5 18.5,5 18,5.5 U1.44 18,8.25 17.5,8.75 17.5,10.12 v17,10.62 | v22.38,27.88 R14.2
  Bottom 0.254: v17,10.62 16.12,11.5 13.75,11.5 12,13.25 12,16.25 14,18.25 14,23.88 18,27.88 v22.38,27.88
PA12  (via drill 0.38)
  Top 0.254: U1.45 18.5,9.62 v18.38,9.75 | v22.38,18.25 R15.2
  Route15 0.254: v22.38,18.25 22.38,15.5 20.5,13.62 19.12,13.62 18.38,12.88 v18.38,9.75
PB0  (via drill 0.38)
  Top 0.254: U1.26 9.5,11.25 v9.25,11.5 | v6.12,9.88 4.88,8.62 CN2.3
  Route2 0.254: v6.12,9.88 7.62,9.88 v9.25,11.5
PB1
  Top 0.254: U1.27 7.62,10.75 7.5,10.62 5.75,10.62 4.75,9.62 CN2.4
PB4  (via drill 0.38)
  Top 0.254: U1.56 20.38,11.75 20.12,11.5 14.5,11.5 13.38,10.38 13.38,8.62 v12.75,8 | v7.62,8 7.25,7.62 CN2.2
  Route2 0.254: v7.62,8 v12.75,8
PB5  (via drill 0.38)
  Top 0.254: U1.57 19.75,12.25 v19.5,12.5 | v6.38,6.88 6.12,6.62 CN2.1
  Route15 0.254: v19.5,12.5 21.5,10.5 21.5,8.5 24.88,5.12 24.88,3 24,2.12 22,2.12 21.25,2.88 18.5,2.88 17.38,4 13.25,4 10.38,6.88 v6.38,6.88
PB6  (via drill 0.38)
  Top 0.254: U1.58 22.62,12.75 23.12,12.25 v24.75,12.25
  Route2 0.254: v24.75,12.25 25,12.5 40.75,12.5 42.5,14.25 44.12,14.25 44.62,14.75 44.62,22.62 43.5,23.75 S1.3
PB7  (via drill 0.38)
  Top 0.254: v23.62,13 23.38,13.25 U1.59
  Route15 0.254: v23.62,13 35.12,13 43.38,21.25 S2.3
PB8  (via drill 0.38)
  Top 0.254: U1.61 19.88,14.25 v19.62,14.5
  Route2 0.254: v19.62,14.5 22.38,11.75 24,11.75 24.25,11.5 27.75,11.5 28.5,10.75 v30.75,10.75
  Route15 0.254: v30.75,10.75 36.12,10.75 43.38,18 S3.3
PB9  (via drill 0.38)
  Top 0.254: U1.62 20.62,14.75 20.25,15.12 20.25,16 v21.12,16.88
  Route2 0.254: v21.12,16.88 21.25,17 41.88,17 43.38,15.5 S4.3
PB10  (via drill 0.38)
  Top 0.254: v34.75,6.5 35.12,6.88 v38.25,6.88 39,7.62 39,9.75 38.62,10.12 38.62,11.62 39.38,12.38 U2.6 | U1.29 9,9.75 v8.38,9.12
  Route2 0.254: v26.88,3.75 v32.38,9.25
  Bottom 0.254: 37.05,6.58 RN1.5 37.95,6.58 v38.25,6.88 | v34.75,6.5 33.88,6.5 33.5,6.88 33.5,7.5 U4.3 | U4.3 33.5,7.6 | v8.38,9.12 13.25,4.25 26.38,4.25 v26.88,3.75 | v32.38,9.25 33.5,8.12 33.45,8.07 U4.3
PB11  (via drill 0.38)
  Top 0.254: U1.30 v12.5,9.25 | v33.5,4.5 36.88,4.5 v38.25,5.88 41.25,8.88 41.25,13 40.6,13.64 U2.7
  Bottom 0.254: RN1.6 37.23,5.78 37.25,5.75 38.12,5.75 v38.25,5.88 | U4.6 33.5,3.25 v33.5,4.5 30.5,4.5 28.75,6.25 15.5,6.25 v12.5,9.25
PB12
  Top 0.254: U1.33 12.3,6.55 10.12,4.38 CN3.6
PB13
  Top 0.254: U1.34 13,5.62 12.62,5.25 12,5.25 11.12,4.38 CN3.5
PB14
  Top 0.254: U1.35 13.5,5.38 12.88,4.75 12.5,4.75 12.12,4.38 CN3.4
PB15
  Top 0.254: U1.36 14,5.12 13.12,4.25 CN3.3
PC0  (via drill 0.38)
  Top 0.254: v16.75,19.62 16.5,19.38 U1.8 | CN1.4 v6,23
  Route15 0.254: v6,23 7,23 11.75,18.25 15.62,18.25 16.75,19.38 v16.75,19.62
PC1  (via drill 0.38)
  Top 0.254: v15.38,20.38 16,19.75 U1.9 | CN1.5 6.75,24 v7.75,25
  Route15 0.254: v15.38,20.38 14.88,20.88 11.88,20.88 v7.75,25
PC2  (via drill 0.38)
  Top 0.254: U1.10 15.5,18.75 v15.25,19 | CN1.6 5.5,25 v6.5,26
  Route15 0.254: v6.5,26 6.5,24.75 11.25,20 14.25,20 v15.25,19
PC3  (via drill 0.38)
  Top 0.254: U1.11 15,16.38 v15.75,15.62
  Top 0.406: v41,28.5 C22.1 43.42,27.98 SL1.3
  Route15 0.254: v21.62,27 39.5,27 v41,28.5
  Bottom 0.254: v15.75,15.62 17.88,17.75 17.88,24.25 20.62,27 v21.62,27
PC4  (via drill 0.38)
  Top 0.254: R7.2 R4.1 35.62,18.85 35.62,24.88 31,29.5 13.75,29.5 7.88,23.62 v7.88,20.38 | U1.24 9.62,12.25 v9,12.88
  Route15 0.254: v9,12.88 9,19.25 v7.88,20.38
PC5  (via drill 0.38)
  Top 0.254: U1.25 14,11.75 v14.5,12.25
  Route2 0.254: v7.5,18.38 7.5,17.88 13.12,12.25 v14.5,12.25
  Bottom 0.254: R8.2 6.12,24.5 6.38,24.25 8.22,24.25 R6.1
  Bottom 0.406: R6.1 9.22,20.1 v7.5,18.38
PC6  (via drill 0.38)
  Top 0.254: U1.37 14.5,5.62 15.38,4.75 15.62,4.75 17,3.38 v17,2.75
  Route2 0.254: v29.5,3.75 29.5,4.12 35.5,10.12 40.55,10.12 S5.3
  Bottom 0.254: v17,2.75 18.62,1.12 26.88,1.12 v29.5,3.75
PC7  (via drill 0.38)
  Top 0.254: U1.38 15,8.38 v14.62,8.75
  Route2 0.254: S6.3 43.38,9.75 44.62,8.5 44.62,4.12 43.75,3.25 40.5,3.25 39.5,2.25 23.38,2.25 v22.12,3.5
  Route15 0.254: v14.62,8.75 17.88,5.5 17.88,4.62 19,3.5 v22.12,3.5
PC8
  Top 0.254: U1.39 15.5,5.62 17.75,3.38 17.75,2.12 19.38,0.5 36.75,0.5 43.42,7.17 S7.3
PC9  (via drill 0.38)
  Top 0.254: v15.5,9.25 16,8.75 U1.40
  Route2 0.254: S8.3 40.88,4.75 38.88,2.75 24,2.75 v23.5,3.25
  Route15 0.254: v15.5,9.25 20.38,4.38 22.38,4.38 v23.5,3.25
PC10  (via drill 0.38)
  Top 0.254: U1.51 20.62,9.25 v20,8.62 | v8.12,2.12 CN3.8
  Route2 0.254: v20,8.62 20,4.62 19.12,3.75 17,3.75 14,0.75 9.5,0.75 v8.12,2.12
PC11  (via drill 0.38)
  Top 0.254: v20,9.75 U1.52 | v10.38,1.88 10.12,1.88 9.12,2.88 CN3.7
  Route2 0.254: v20,9.75 12.12,1.88 v10.38,1.88
PC12  (via drill 0.38)
  Top 0.254: U1.53 22.62,10.25 23.12,9.75 v23.12,9.25 | R2.1 27.1,1.77 24.88,4 23.5,4 v22.12,5.38
  Route2 0.254: v22.12,5.38 23.12,6.38 v23.12,9.25
PC13  (via drill 0.38)
  Top 0.254: U1.2 19.5,18.75 v19.25,19 | R3.1 11.1,28.23 v10.25,27.38
  Route15 0.254: v10.25,27.38 19.5,27.38 v21.12,25.75
  Bottom 0.254: v19.25,19 19.5,19.25 19.5,24.12 v21.12,25.75
PC15  (via drill 0.38)
  Top 0.254: U1.4 18.5,20 v18.75,20.25 | U2.2 36.12,12.38 36.88,13.12 36.88,15.38 37.12,15.62 v39.25,15.62
  Route2 0.254: v39.25,15.62 37.75,14.12 22.12,14.12 20,16.25 20,19.38 19.12,20.25 v18.75,20.25
PD2  (via drill 0.38)
  Top 0.254: v19.25,10.75 U1.54 | CN1.7 1.62,26 v1.38,25.75
  Route2 0.254: v19.25,10.75 18.5,11.5 12.62,11.5 1.38,22.75 v1.38,25.75
RESET  (via drill 0.38)
  Top 0.254: v17.5,12.38 17,12.88 U1.7 | v29.12,11.62 29.12,11.88 28.38,12.62 27.02,12.62 C11.1
  Top 0.406: CN4.10 26.02,11.05 C11.1
  Bottom 0.254: v17.5,12.38 18.25,11.62 24.12,11.62 24.5,11.25 28.75,11.25 v29.12,11.62
TCLK
  Top 0.254: U1.49 22.25,8.25 23,7.5 23,7 23.89,6.11 CN4.4
TDI
  Top 0.254: 24.78,8.75 CN4.8 24.74,8.5 22.88,8.5 22.62,8.75 U1.50
TDO  (via drill 0.38)
  Top 0.254: 25.01,7.5 CN4.6 26.62,7.38 v26.88,7.12 | v23.75,10.88 23.38,11.25 U1.55
  Bottom 0.254: v26.88,7.12 26.88,7.75 v23.75,10.88
TMS
  Top 0.254: U1.46 19,7.5 19.25,7.75 21.12,7.75 24.04,4.83 CN4.2
V_UNREG  (via drill 0.4)
  Route2 0.305: v30.75,9.25 24.38,9.25 23.5,10.12 23.25,10.12 19.88,13.5 19.5,13.5 16,17 10.12,17 v5.62,21.5
  Bottom 0.254: RN1.2 35.85,5 35.62,5 35.25,5.38 32.88,5.38 32.12,6.12 32.12,7.55 U4.1 | U4.5 35.08,3.2 C19.1
  Bottom 0.305: RN1.2 RN1.1 | v30.75,9.25 32.15,7.85 U4.1 | D1.3 5.38,21.75 v5.62,21.5
  Bottom 0.406: C19.1 35.88,2.62 RN1.1
  Bottom 0.61: U3.1 2.4,4.12 1.75,4.12 1.38,4.5 1.38,6.12 | 1.38,6.12 1.38,9.07 C26.1 0.62,11.93 0.62,20.38 2,21.75 D1.3 | U3.3 1.43,6.08 1.38,6.12
VUSB  (via drill 0.5, 0.6)
  Top 0.254: X1.VBUS 34.23,18.55 R4.2
  Top 0.406: X1.VBUS 34.23,22.27 v33.75,22.75
  Route15 0.61: v33.75,22.75 32.12,24.38 15,24.38 13.5,25.88 9.25,25.88 7.62,27.5 5.38,27.5 v2.25,24.38
  Bottom 0.61: D1.1 3.92,22.7 v2.25,24.38

### Text on the board
Document: Angus Peart
_tsilk: PWR | I2C Bus
_bsilk: Telem + Aux | Pwr Sense | S1 | S2 | ~ | + | - | S3 | RC Receiver | S4 | Version 2.0 | S5 | + | - | ~ | S6 | S7 | S8 | C | D | - | + | GPS + AHRS